# Altium schematic sheet B2B-CONNECTOR.SchDoc
size A3; SheetNumber: 3; SheetTotal: 3
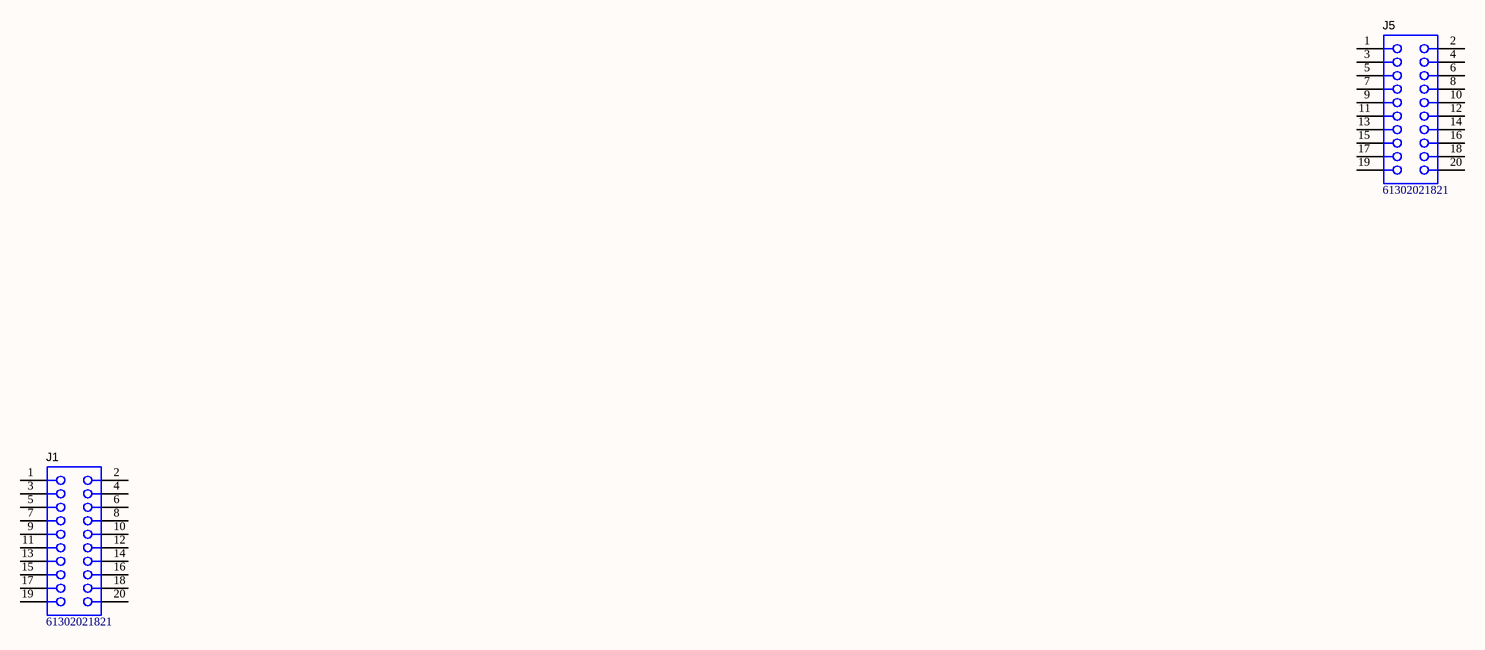
[diagram p0: B2B-CONNECTOR.SchDoc]

## Parts
J1  61302021821  [61302021821]
J5  61302021821  [61302021821]

## Nets

Not connected (* = marked no-connect by the designer): J1 1 2 3 4 5 6 7 8 9 10 11 12 13 14 15 16 17 18 19 20; J5 1 2 3 4 5 6 7 8 9 10 11 12 13 14 15 16 17 18 19 20

## Library data of the parts
J1 J5 = CMP-1502-01350-3: NexarPartId: 61924746; Current Rating: 3A; Operating Supply Voltage: 250V; Gender: Female; Contact Resistance: 20mΩ; System: Connector; RoHS: Non-Compliant; Orientation: Vertical; Number of Pins: 20; Lead Pitch: 2.54mm